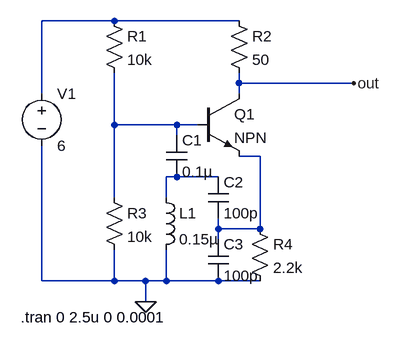
[diagram p0: schematic WtfPart2.asc]
WtfPart2.asc, the LTspice schematic file:
Version 4
SHEET 1 880 680
WIRE 112 -48 0 -48
WIRE 304 -48 112 -48
WIRE 304 48 304 32
WIRE 480 48 304 48
WIRE 0 64 0 -48
WIRE 304 64 304 48
WIRE 112 112 112 32
WIRE 208 112 112 112
WIRE 240 112 208 112
WIRE 208 128 208 112
WIRE 336 160 304 160
WIRE 208 192 192 192
WIRE 272 192 208 192
WIRE 112 224 112 112
WIRE 192 224 192 192
WIRE 272 272 272 256
WIRE 336 272 336 160
WIRE 336 272 272 272
WIRE 272 288 272 272
WIRE 0 352 0 144
WIRE 112 352 112 304
WIRE 112 352 0 352
WIRE 160 352 112 352
WIRE 192 352 192 304
WIRE 192 352 160 352
WIRE 272 352 192 352
WIRE 336 352 272 352
WIRE 160 384 160 352
FLAG 160 384 0
FLAG 480 48 out
SYMBOL voltage 0 48 R0
WINDOW 123 0 0 Left 0
WINDOW 39 0 0 Left 0
SYMATTR InstName V1
SYMATTR Value 6
SYMBOL res 288 -64 R0
SYMATTR InstName R2
SYMATTR Value 50
SYMBOL npn 240 64 R0
SYMATTR InstName Q1
SYMBOL cap 192 128 R0
SYMATTR InstName C1
SYMATTR Value 0.1µ
SYMBOL ind 176 208 R0
SYMATTR InstName L1
SYMATTR Value 0.15µ
SYMBOL res 96 208 R0
SYMATTR InstName R3
SYMATTR Value 10k
SYMBOL res 96 -64 R0
SYMATTR InstName R1
SYMATTR Value 10k
SYMBOL cap 256 192 R0
SYMATTR InstName C2
SYMATTR Value 100p
SYMBOL cap 256 288 R0
SYMATTR InstName C3
SYMATTR Value 100p
SYMBOL res 320 256 R0
SYMATTR InstName R4
SYMATTR Value 2.2k
TEXT -32 408 Left 2 !.tran 0 2.5u 0 0.0001

The netlist it stands for:
* WtfPart2.asc
V1 N001 0 6
R2 N001 out 50
Q1 out N002 N003 0 NPN
C1 N002 N004 0.1µ
L1 N004 0 0.15µ
R3 N002 0 10k
R1 N001 N002 10k
C2 N004 N003 100p
C3 N003 0 100p
R4 N003 0 2.2k
.model NPN NPN
.model PNP PNP
.lib standard.bjt
.tran 0 2.5u 0 0.0001
.backanno
.end